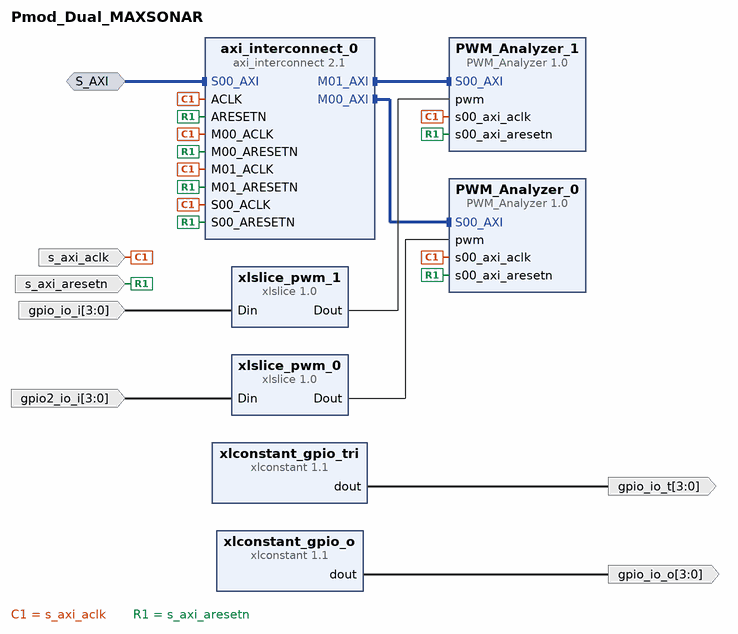
[diagram p0: block diagram of the top level]
# Vivado block design Pmod_Dual_MAXSONAR, xc7a35ticsg324-1L, Vivado 2016.4
create_bd_design Pmod_Dual_MAXSONAR

create_bd_intf_port -mode Slave -vlnv xilinx.com:interface:aximm_rtl:1.0 S_AXI
set_property -dict [list \
  CONFIG.DATA_WIDTH 32 \
  CONFIG.PROTOCOL AXI4 \
  CONFIG.FREQ_HZ 83333333 \
  CONFIG.ID_WIDTH 0 \
  CONFIG.ADDR_WIDTH 31 \
  CONFIG.AWUSER_WIDTH 0 \
  CONFIG.ARUSER_WIDTH 0 \
  CONFIG.WUSER_WIDTH 0 \
  CONFIG.RUSER_WIDTH 0 \
  CONFIG.BUSER_WIDTH 0 \
  CONFIG.READ_WRITE_MODE READ_WRITE \
  CONFIG.HAS_BURST 1 \
  CONFIG.HAS_LOCK 1 \
  CONFIG.HAS_PROT 1 \
  CONFIG.HAS_CACHE 1 \
  CONFIG.HAS_QOS 1 \
  CONFIG.HAS_REGION 0 \
  CONFIG.HAS_WSTRB 1 \
  CONFIG.HAS_BRESP 1 \
  CONFIG.HAS_RRESP 1 \
  CONFIG.SUPPORTS_NARROW_BURST 1 \
  CONFIG.NUM_READ_OUTSTANDING 2 \
  CONFIG.NUM_WRITE_OUTSTANDING 2 \
  CONFIG.MAX_BURST_LENGTH 256 \
  CONFIG.NUM_READ_THREADS 1 \
  CONFIG.NUM_WRITE_THREADS 1 \
  CONFIG.RUSER_BITS_PER_BYTE 0 \
  CONFIG.WUSER_BITS_PER_BYTE 0 \
] [get_bd_intf_ports S_AXI]
create_bd_port -dir I -type clk s_axi_aclk
set_property -dict {CONFIG.FREQ_HZ 83333333 CONFIG.CLK_DOMAIN Pmod_MAXSONAR_ACLK} [get_bd_ports s_axi_aclk]
create_bd_port -dir I -type rst s_axi_aresetn
create_bd_port -dir I -from 3 -to 0 gpio_io_i
create_bd_port -dir I -from 3 -to 0 gpio2_io_i
create_bd_port -dir O -from 3 -to 0 gpio_io_t
create_bd_port -dir O -from 3 -to 0 gpio_io_o

create_bd_cell -type ip -vlnv digilentinc.com:IP:PWM_Analyzer:1.0 PWM_Analyzer_0
create_bd_cell -type ip -vlnv digilentinc.com:IP:PWM_Analyzer:1.0 PWM_Analyzer_1
create_bd_cell -type ip -vlnv xilinx.com:ip:axi_interconnect:2.1 axi_interconnect_0
create_bd_cell -type ip -vlnv xilinx.com:ip:xlslice:1.0 xlslice_pwm_0
set_property -dict {CONFIG.DOUT_WIDTH 1 CONFIG.DIN_TO 3 CONFIG.DIN_FROM 3 CONFIG.DIN_WIDTH 4} [get_bd_cells xlslice_pwm_0]
create_bd_cell -type ip -vlnv xilinx.com:ip:xlslice:1.0 xlslice_pwm_1
set_property -dict {CONFIG.DOUT_WIDTH 1 CONFIG.DIN_TO 3 CONFIG.DIN_FROM 3 CONFIG.DIN_WIDTH 4} [get_bd_cells xlslice_pwm_1]
create_bd_cell -type ip -vlnv xilinx.com:ip:xlconstant:1.1 xlconstant_gpio_tri
set_property -dict {CONFIG.CONST_WIDTH 4 CONFIG.CONST_VAL 15} [get_bd_cells xlconstant_gpio_tri]
create_bd_cell -type ip -vlnv xilinx.com:ip:xlconstant:1.1 xlconstant_gpio_o
set_property -dict {CONFIG.CONST_WIDTH 4 CONFIG.CONST_VAL 0} [get_bd_cells xlconstant_gpio_o]

# ---- connections ----

connect_bd_intf_net [get_bd_intf_pins PWM_Analyzer_0/S00_AXI] [get_bd_intf_pins axi_interconnect_0/M00_AXI]
connect_bd_intf_net [get_bd_intf_pins PWM_Analyzer_1/S00_AXI] [get_bd_intf_pins axi_interconnect_0/M01_AXI]
connect_bd_intf_net [get_bd_intf_ports S_AXI] [get_bd_intf_pins axi_interconnect_0/S00_AXI]
connect_bd_net -net ACLK_1 [get_bd_ports s_axi_aclk] \
  [get_bd_pins PWM_Analyzer_0/s00_axi_aclk] [get_bd_pins PWM_Analyzer_1/s00_axi_aclk] [get_bd_pins axi_interconnect_0/ACLK] \
  [get_bd_pins axi_interconnect_0/S00_ACLK] [get_bd_pins axi_interconnect_0/M00_ACLK] \
  [get_bd_pins axi_interconnect_0/M01_ACLK]
connect_bd_net -net ARESETN_1 [get_bd_ports s_axi_aresetn] \
  [get_bd_pins PWM_Analyzer_0/s00_axi_aresetn] [get_bd_pins PWM_Analyzer_1/s00_axi_aresetn] \
  [get_bd_pins axi_interconnect_0/ARESETN] [get_bd_pins axi_interconnect_0/S00_ARESETN] \
  [get_bd_pins axi_interconnect_0/M00_ARESETN] [get_bd_pins axi_interconnect_0/M01_ARESETN]
connect_bd_net [get_bd_pins xlslice_pwm_0/Dout] [get_bd_pins PWM_Analyzer_0/pwm]
connect_bd_net [get_bd_pins xlslice_pwm_1/Dout] [get_bd_pins PWM_Analyzer_1/pwm]
connect_bd_net -net Din_1 [get_bd_ports gpio_io_i] [get_bd_pins xlslice_pwm_1/Din]
connect_bd_net -net Din_2 [get_bd_ports gpio2_io_i] [get_bd_pins xlslice_pwm_0/Din]
connect_bd_net -net xlconstant_0_dout [get_bd_pins xlconstant_gpio_tri/dout] [get_bd_ports gpio_io_t]
connect_bd_net [get_bd_pins xlconstant_gpio_o/dout] [get_bd_ports gpio_io_o]

# ---- address map ----
assign_bd_address -offset 0x45A00000 -range 64K -target_address_space [get_bd_addr_spaces S_AXI] [get_bd_addr_segs PWM_Analyzer_0/S00_AXI/S00_AXI_reg]
assign_bd_address -offset 0x45A10000 -range 64K -target_address_space [get_bd_addr_spaces S_AXI] [get_bd_addr_segs PWM_Analyzer_1/S00_AXI/S00_AXI_reg]

validate_bd_design
save_bd_design
